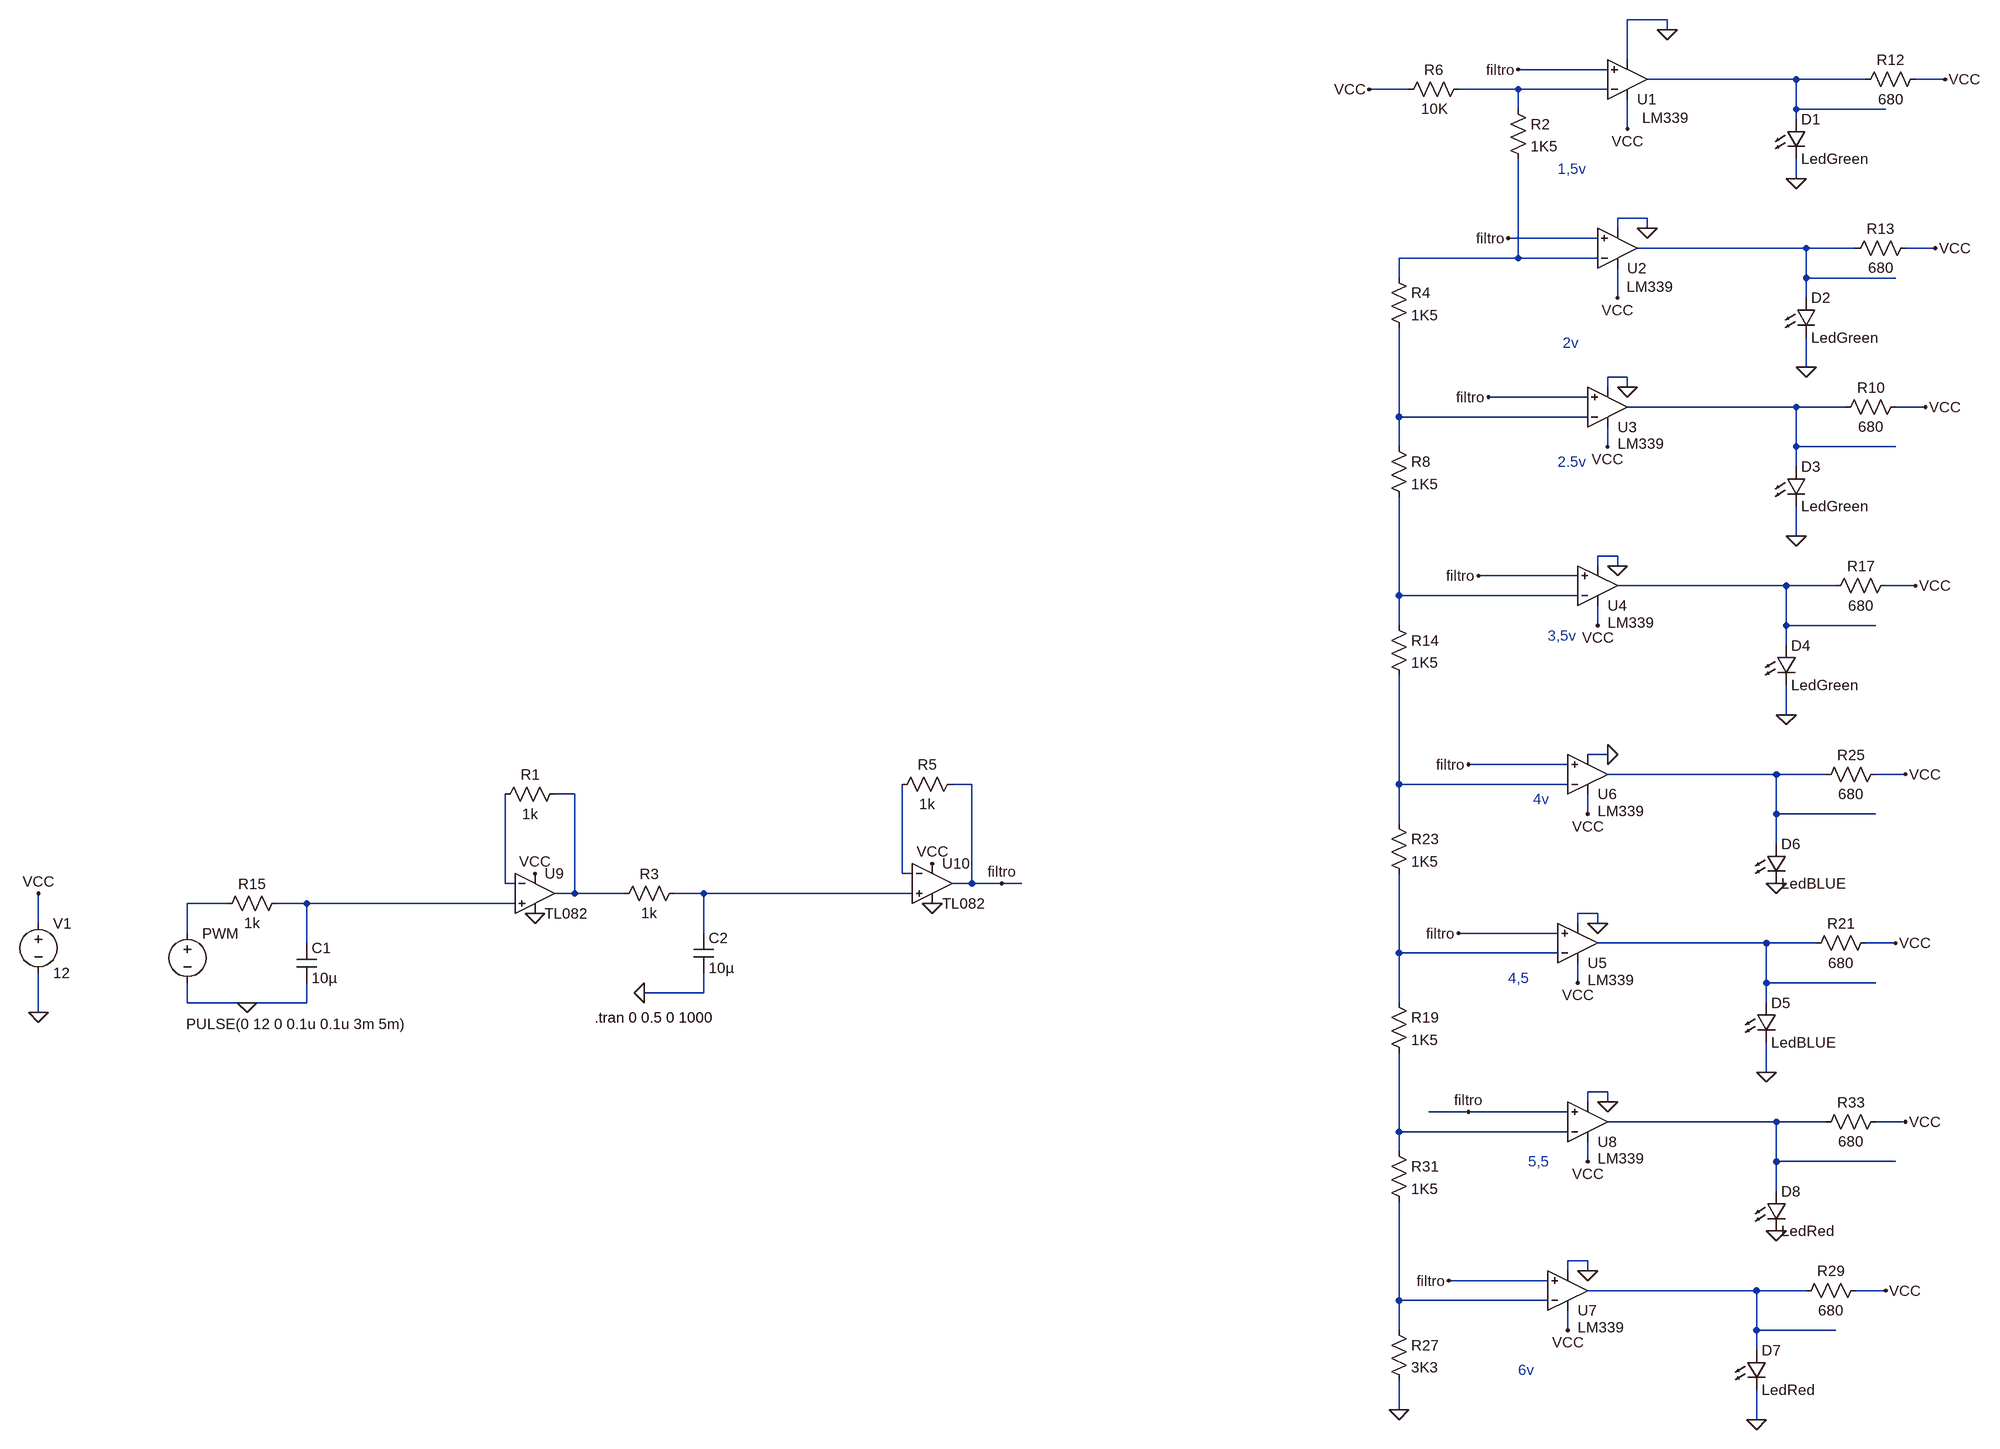
[diagram p0: schematic vumetro.asc]
vumetro.asc, the LTspice schematic file:
Version 4
SHEET 1 2160 680
WIRE 320 -2480 256 -2480
WIRE 320 -2464 320 -2480
WIRE 256 -2416 256 -2480
WIRE 224 -2400 80 -2400
WIRE 528 -2384 288 -2384
WIRE 640 -2384 528 -2384
WIRE 768 -2384 720 -2384
WIRE -96 -2368 -160 -2368
WIRE 80 -2368 -16 -2368
WIRE 112 -2368 80 -2368
WIRE 224 -2368 112 -2368
WIRE 80 -2336 80 -2368
WIRE 528 -2336 528 -2384
WIRE 608 -2336 528 -2336
WIRE 672 -2336 608 -2336
WIRE 528 -2320 528 -2336
WIRE 256 -2304 256 -2352
WIRE 528 -2224 528 -2256
WIRE 288 -2160 240 -2160
WIRE 240 -2144 240 -2160
WIRE 288 -2144 288 -2160
WIRE 208 -2128 64 -2128
WIRE 544 -2112 272 -2112
WIRE 624 -2112 544 -2112
WIRE 752 -2112 704 -2112
WIRE 80 -2096 80 -2256
WIRE 80 -2096 -112 -2096
WIRE 112 -2096 80 -2096
WIRE 208 -2096 112 -2096
WIRE -112 -2064 -112 -2096
WIRE 544 -2064 544 -2112
WIRE 640 -2064 544 -2064
WIRE 688 -2064 640 -2064
WIRE 240 -2032 240 -2080
WIRE 544 -2032 544 -2064
WIRE 544 -1920 544 -1968
WIRE 256 -1904 224 -1904
WIRE 224 -1888 224 -1904
WIRE 256 -1888 256 -1904
WIRE 192 -1872 32 -1872
WIRE 528 -1856 256 -1856
WIRE 608 -1856 528 -1856
WIRE 736 -1856 688 -1856
WIRE -112 -1840 -112 -1984
WIRE 96 -1840 -112 -1840
WIRE 192 -1840 96 -1840
WIRE -112 -1792 -112 -1840
WIRE 224 -1792 224 -1824
WIRE 528 -1792 528 -1856
WIRE 608 -1792 528 -1792
WIRE 688 -1792 608 -1792
WIRE 528 -1760 528 -1792
WIRE 528 -1648 528 -1696
WIRE 240 -1616 208 -1616
WIRE 208 -1600 208 -1616
WIRE 240 -1600 240 -1616
WIRE 176 -1584 16 -1584
WIRE 512 -1568 240 -1568
WIRE 592 -1568 512 -1568
WIRE 720 -1568 672 -1568
WIRE -112 -1552 -112 -1712
WIRE 80 -1552 -112 -1552
WIRE 176 -1552 80 -1552
WIRE -112 -1504 -112 -1552
WIRE 208 -1504 208 -1536
WIRE 512 -1504 512 -1568
WIRE 608 -1504 512 -1504
WIRE 656 -1504 608 -1504
WIRE 512 -1472 512 -1504
WIRE 512 -1360 512 -1408
WIRE 224 -1296 192 -1296
WIRE 160 -1280 0 -1280
WIRE 496 -1264 224 -1264
WIRE 576 -1264 496 -1264
WIRE 704 -1264 656 -1264
WIRE -800 -1248 -832 -1248
WIRE -112 -1248 -112 -1424
WIRE 64 -1248 -112 -1248
WIRE 160 -1248 64 -1248
WIRE -1440 -1232 -1472 -1232
WIRE 192 -1200 192 -1232
WIRE 496 -1200 496 -1264
WIRE 608 -1200 496 -1200
WIRE 656 -1200 608 -1200
WIRE -112 -1184 -112 -1248
WIRE 496 -1152 496 -1200
WIRE -912 -1104 -912 -1248
WIRE -896 -1104 -912 -1104
WIRE -1552 -1088 -1552 -1232
WIRE -1536 -1088 -1552 -1088
WIRE -800 -1088 -800 -1248
WIRE -800 -1088 -832 -1088
WIRE -752 -1088 -800 -1088
WIRE -720 -1088 -752 -1088
WIRE -1440 -1072 -1440 -1232
WIRE -1440 -1072 -1472 -1072
WIRE -1360 -1072 -1440 -1072
WIRE -1232 -1072 -1280 -1072
WIRE -896 -1072 -1232 -1072
WIRE -2000 -1056 -2064 -1056
WIRE -1872 -1056 -1920 -1056
WIRE -1536 -1056 -1872 -1056
WIRE 208 -1040 176 -1040
WIRE -2304 -1024 -2304 -1072
WIRE 176 -1024 176 -1040
WIRE 208 -1024 208 -1040
WIRE -2064 -1008 -2064 -1056
WIRE -1232 -1008 -1232 -1072
WIRE 144 -1008 -16 -1008
WIRE -1872 -992 -1872 -1056
WIRE 480 -992 208 -992
WIRE 560 -992 480 -992
WIRE 688 -992 640 -992
WIRE -112 -976 -112 -1104
WIRE 32 -976 -112 -976
WIRE 144 -976 32 -976
WIRE 176 -928 176 -960
WIRE 480 -928 480 -992
WIRE 576 -928 480 -928
WIRE 656 -928 576 -928
WIRE -1232 -912 -1232 -944
WIRE -1232 -912 -1328 -912
WIRE -2064 -896 -2064 -928
WIRE -1968 -896 -2064 -896
WIRE -1872 -896 -1872 -928
WIRE -1872 -896 -1968 -896
WIRE -112 -896 -112 -976
WIRE 480 -896 480 -928
WIRE -2304 -880 -2304 -944
WIRE 480 -784 480 -832
WIRE 224 -752 192 -752
WIRE 192 -736 192 -752
WIRE 224 -736 224 -752
WIRE 0 -720 -64 -720
WIRE 160 -720 0 -720
WIRE 496 -704 224 -704
WIRE 576 -704 496 -704
WIRE 704 -704 656 -704
WIRE -112 -688 -112 -816
WIRE 80 -688 -112 -688
WIRE 160 -688 80 -688
WIRE -112 -656 -112 -688
WIRE 192 -640 192 -672
WIRE 496 -640 496 -704
WIRE 608 -640 496 -640
WIRE 688 -640 608 -640
WIRE 496 -592 496 -640
WIRE 192 -480 160 -480
WIRE 160 -464 160 -480
WIRE 192 -464 192 -480
WIRE 128 -448 -32 -448
WIRE 464 -432 192 -432
WIRE 544 -432 464 -432
WIRE 672 -432 624 -432
WIRE -112 -416 -112 -576
WIRE 32 -416 -112 -416
WIRE 128 -416 32 -416
WIRE -112 -368 -112 -416
WIRE 160 -368 160 -400
WIRE 464 -368 464 -432
WIRE 544 -368 464 -368
WIRE 592 -368 544 -368
WIRE 464 -336 464 -368
WIRE -112 -240 -112 -288
WIRE 464 -224 464 -272
FLAG 528 -2224 0
FLAG 544 -1920 0
FLAG 528 -1648 0
FLAG -2304 -880 0
FLAG -160 -2368 VCC
FLAG -2304 -1072 VCC
FLAG 256 -2304 VCC
FLAG 240 -2032 VCC
FLAG 224 -1792 VCC
FLAG 320 -2464 0
FLAG 288 -2144 0
FLAG 256 -1888 0
FLAG 768 -2384 VCC
FLAG 752 -2112 VCC
FLAG 736 -1856 VCC
FLAG -1968 -896 0
FLAG 512 -1360 0
FLAG 208 -1504 VCC
FLAG 240 -1600 0
FLAG 720 -1568 VCC
FLAG 480 -784 0
FLAG 176 -928 VCC
FLAG 208 -1024 0
FLAG 688 -992 VCC
FLAG 192 -1200 VCC
FLAG 224 -1296 0
FLAG 704 -1264 VCC
FLAG 496 -1088 0
FLAG -112 -240 0
FLAG 464 -224 0
FLAG 160 -368 VCC
FLAG 192 -464 0
FLAG 672 -432 VCC
FLAG 192 -640 VCC
FLAG 224 -736 0
FLAG 704 -704 VCC
FLAG 496 -528 0
FLAG 80 -2400 filtro
FLAG 64 -2128 filtro
FLAG 0 -1280 filtro
FLAG -16 -1008 filtro
FLAG 0 -720 filtro
FLAG -32 -448 filtro
FLAG 16 -1584 filtro
FLAG 32 -1872 filtro
FLAG -1504 -1040 0
FLAG -1504 -1104 VCC
FLAG -1328 -912 0
FLAG -752 -1088 filtro
FLAG -864 -1056 0
FLAG -864 -1120 VCC
DATAFLAG 112 -2368 ""
DATAFLAG 112 -2096 ""
DATAFLAG 96 -1840 ""
DATAFLAG 80 -1552 ""
DATAFLAG 64 -1248 ""
DATAFLAG 32 -976 ""
DATAFLAG 80 -688 ""
DATAFLAG 32 -416 ""
DATAFLAG 608 -1200 ""
DATAFLAG 576 -928 ""
DATAFLAG 608 -640 ""
DATAFLAG 544 -368 ""
DATAFLAG 608 -1504 ""
DATAFLAG 608 -1792 ""
DATAFLAG 640 -2064 ""
DATAFLAG 608 -2336 ""
SYMBOL LM339 256 -2384 M180
WINDOW 3 24 -62 Left 2
SYMATTR InstName U1
SYMBOL LM339 240 -2112 M180
WINDOW 3 15 -62 Left 2
SYMATTR InstName U2
SYMBOL LM339 224 -1856 M180
WINDOW 3 16 -59 Left 2
SYMATTR InstName U3
SYMBOL LED 512 -2320 R0
SYMATTR InstName D1
SYMATTR Value LedGreen
SYMBOL LED 528 -2032 R0
SYMATTR InstName D2
SYMATTR Value LedGreen
SYMBOL LED 512 -1760 R0
SYMATTR InstName D3
SYMATTR Value LedGreen
SYMBOL res 64 -2352 R0
SYMATTR InstName R2
SYMATTR Value 1K5
SYMBOL res -128 -2080 R0
SYMATTR InstName R4
SYMATTR Value 1K5
SYMBOL res -128 -1808 R0
SYMATTR InstName R8
SYMATTR Value 1K5
SYMBOL res 0 -2384 R90
WINDOW 0 0 56 VBottom 2
WINDOW 3 32 55 VTop 2
SYMATTR InstName R6
SYMATTR Value 10K
SYMBOL voltage -2304 -1040 R0
WINDOW 123 0 0 Left 2
WINDOW 39 0 0 Left 2
SYMATTR InstName V1
SYMATTR Value 12
SYMBOL res 736 -2400 R90
WINDOW 0 0 56 VBottom 2
WINDOW 3 32 56 VTop 2
SYMATTR InstName R12
SYMATTR Value 680
SYMBOL res 720 -2128 R90
WINDOW 0 0 56 VBottom 2
WINDOW 3 32 56 VTop 2
SYMATTR InstName R13
SYMATTR Value 680
SYMBOL res -1904 -1072 R90
WINDOW 0 0 56 VBottom 2
WINDOW 3 32 56 VTop 2
SYMATTR InstName R15
SYMATTR Value 1k
SYMBOL cap -1888 -992 R0
SYMATTR InstName C1
SYMATTR Value 10µ
SYMBOL voltage -2064 -1024 R0
WINDOW 3 -2 162 Left 2
WINDOW 123 0 0 Left 2
WINDOW 39 0 0 Left 2
SYMATTR Value PULSE(0 12 0 0.1u 0.1u 3m 5m)
SYMATTR InstName PWM
SYMBOL res 704 -1872 R90
WINDOW 0 0 56 VBottom 2
WINDOW 3 32 56 VTop 2
SYMATTR InstName R10
SYMATTR Value 680
SYMBOL LM339 208 -1568 M180
WINDOW 3 16 -59 Left 2
SYMATTR InstName U4
SYMBOL LED 496 -1472 R0
SYMATTR InstName D4
SYMATTR Value LedGreen
SYMBOL res -128 -1520 R0
SYMATTR InstName R14
SYMATTR Value 1K5
SYMBOL res 688 -1584 R90
WINDOW 0 0 56 VBottom 2
WINDOW 3 32 56 VTop 2
SYMATTR InstName R17
SYMATTR Value 680
SYMBOL LM339 176 -992 M180
WINDOW 3 16 -59 Left 2
SYMATTR InstName U5
SYMBOL LED 464 -896 R0
SYMATTR InstName D5
SYMATTR Value LedBLUE
SYMBOL res -128 -912 R0
SYMATTR InstName R19
SYMATTR Value 1K5
SYMBOL res 656 -1008 R90
WINDOW 0 0 56 VBottom 2
WINDOW 3 32 56 VTop 2
SYMATTR InstName R21
SYMATTR Value 680
SYMBOL LM339 192 -1264 M180
WINDOW 3 16 -59 Left 2
SYMATTR InstName U6
SYMBOL LED 480 -1152 R0
SYMATTR InstName D6
SYMATTR Value LedBLUE
SYMBOL res -128 -1200 R0
SYMATTR InstName R23
SYMATTR Value 1K5
SYMBOL res 672 -1280 R90
WINDOW 0 0 56 VBottom 2
WINDOW 3 32 56 VTop 2
SYMATTR InstName R25
SYMATTR Value 680
SYMBOL LM339 160 -432 M180
WINDOW 3 16 -59 Left 2
SYMATTR InstName U7
SYMBOL LED 448 -336 R0
SYMATTR InstName D7
SYMATTR Value LedRed
SYMBOL res -128 -384 R0
SYMATTR InstName R27
SYMATTR Value 3K3
SYMBOL res 640 -448 R90
WINDOW 0 0 56 VBottom 2
WINDOW 3 32 56 VTop 2
SYMATTR InstName R29
SYMATTR Value 680
SYMBOL LM339 192 -704 M180
WINDOW 3 16 -59 Left 2
SYMATTR InstName U8
SYMBOL LED 480 -592 R0
SYMATTR InstName D8
SYMATTR Value LedRed
SYMBOL res -128 -672 R0
SYMATTR InstName R31
SYMATTR Value 1K5
SYMBOL res 672 -720 R90
WINDOW 0 0 56 VBottom 2
WINDOW 3 32 56 VTop 2
SYMATTR InstName R33
SYMATTR Value 680
SYMBOL Opamps\\TL082 -1504 -1136 R0
SYMATTR InstName U9
SYMBOL res -1456 -1248 R90
WINDOW 0 0 56 VBottom 2
WINDOW 3 32 56 VTop 2
SYMATTR InstName R1
SYMATTR Value 1k
SYMBOL res -1264 -1088 R90
WINDOW 0 0 56 VBottom 2
WINDOW 3 32 56 VTop 2
SYMATTR InstName R3
SYMATTR Value 1k
SYMBOL cap -1248 -1008 R0
SYMATTR InstName C2
SYMATTR Value 10µ
SYMBOL Opamps\\TL082 -864 -1152 R0
SYMATTR InstName U10
SYMBOL res -816 -1264 R90
WINDOW 0 0 56 VBottom 2
WINDOW 3 32 56 VTop 2
SYMATTR InstName R5
SYMATTR Value 1k
TEXT -1408 -872 Left 2 !.tran 0 0.5 0 1000
TEXT 144 -2240 Left 2 ;1,5v
TEXT 152 -1960 Left 2 ;2v
TEXT 128 -1488 Left 2 ;3,5v
TEXT 80 -304 Left 2 ;6v
TEXT 96 -640 Left 2 ;5,5
TEXT 64 -936 Left 2 ;4,5
TEXT 104 -1224 Left 2 ;4v
TEXT 144 -1768 Left 2 ;2.5v

The netlist it stands for:
* vumetro.asc
* U1: LM339 (symbol LM339 not available, pins judged from their places): In+=filtro In-=N002 V+=VCC V-=0 OUT=N001
* U2: LM339 (symbol LM339 not available, pins judged from their places): In+=filtro In-=N004 V+=VCC V-=0 OUT=N003
* U3: LM339 (symbol LM339 not available, pins judged from their places): In+=filtro In-=N006 V+=VCC V-=0 OUT=N005
D1 N001 0 LedGreen
D2 N003 0 LedGreen
D3 N005 0 LedGreen
R2 N002 N004 1K5
R4 N004 N006 1K5
R8 N006 N008 1K5
R6 N002 VCC 10K
V1 VCC 0 12
R12 VCC N001 680
R13 VCC N003 680
R15 N016 N015 1k
C1 N016 0 10µ
V§PWM N015 0 PULSE(0 12 0 0.1u 0.1u 3m 5m)
R10 VCC N005 680
* U4: LM339 (symbol LM339 not available, pins judged from their places): In+=filtro In-=N008 V+=VCC V-=0 OUT=N007
D4 N007 0 LedGreen
R14 N008 N010 1K5
R17 VCC N007 680
* U5: LM339 (symbol LM339 not available, pins judged from their places): In+=filtro In-=N018 V+=VCC V-=0 OUT=N017
D5 N017 0 LedBLUE
R19 N018 N020 1K5
R21 VCC N017 680
* U6: LM339 (symbol LM339 not available, pins judged from their places): In+=filtro In-=N010 V+=VCC V-=0 OUT=N009
D6 N009 0 LedBLUE
R23 N010 N018 1K5
R25 VCC N009 680
* U7: LM339 (symbol LM339 not available, pins judged from their places): In+=filtro In-=N022 V+=VCC V-=0 OUT=N021
D7 N021 0 LedRed
R27 N022 0 3K3
R29 VCC N021 680
* U8: LM339 (symbol LM339 not available, pins judged from their places): In+=filtro In-=N020 V+=VCC V-=0 OUT=N019
D8 N019 0 LedRed
R31 N020 N022 1K5
R33 VCC N019 680
XU9 N016 N013 VCC 0 N011 TL082  ; pins In+ In- V+ V- OUT
R1 N011 N013 1k
R3 N014 N011 1k
C2 N014 0 10µ
XU10 N014 N012 VCC 0 filtro TL082  ; pins In+ In- V+ V- OUT
R5 filtro N012 1k
.model D D
.lib standard.dio
.tran 0 0.5 0 1000
* 1,5v
* 2v
* 3,5v
* 6v
* 5,5
* 4,5
* 4v
* 2.5v
.backanno
.end